# EAGLE design power_breakout_v1 (EAGLE 9.5.2)
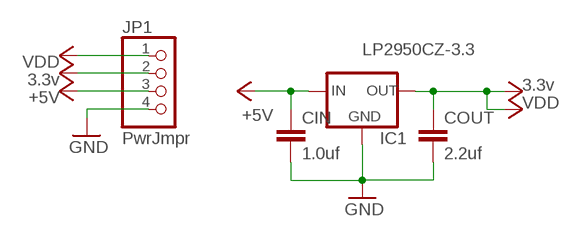
[diagram p0: schematic, sheet 1]

## Parts
CIN  1.0uf  C-EU025-025X050  [C025-025X050]
COUT  2.2uf  C-EU025-025X050  [C025-025X050]
IC1  LP2950CZ-3.3  [TO92]
JP1  PwrJmpr  PINHD-1X4  [1X04]

## Nets
+5V: CIN.1 IC1.3(IN) JP1.3
GND: CIN.2 COUT.2 IC1.2(GND) JP1.4
VCC: COUT.1 IC1.1(OUT) JP1.1 JP1.2 ; supply symbol labelled 3.3v, VDD

## Library data of the parts
CIN COUT = rcl:C-EU: CAPACITOR, European symbol; SPICEPREFIX: C
IC1 = v-reg:LP2950?*: Source: http://cache.national.com/ds/LP/LP2950.pdf
JP1 = pinhead:PINHD-1X4: PIN HEADER

## Board
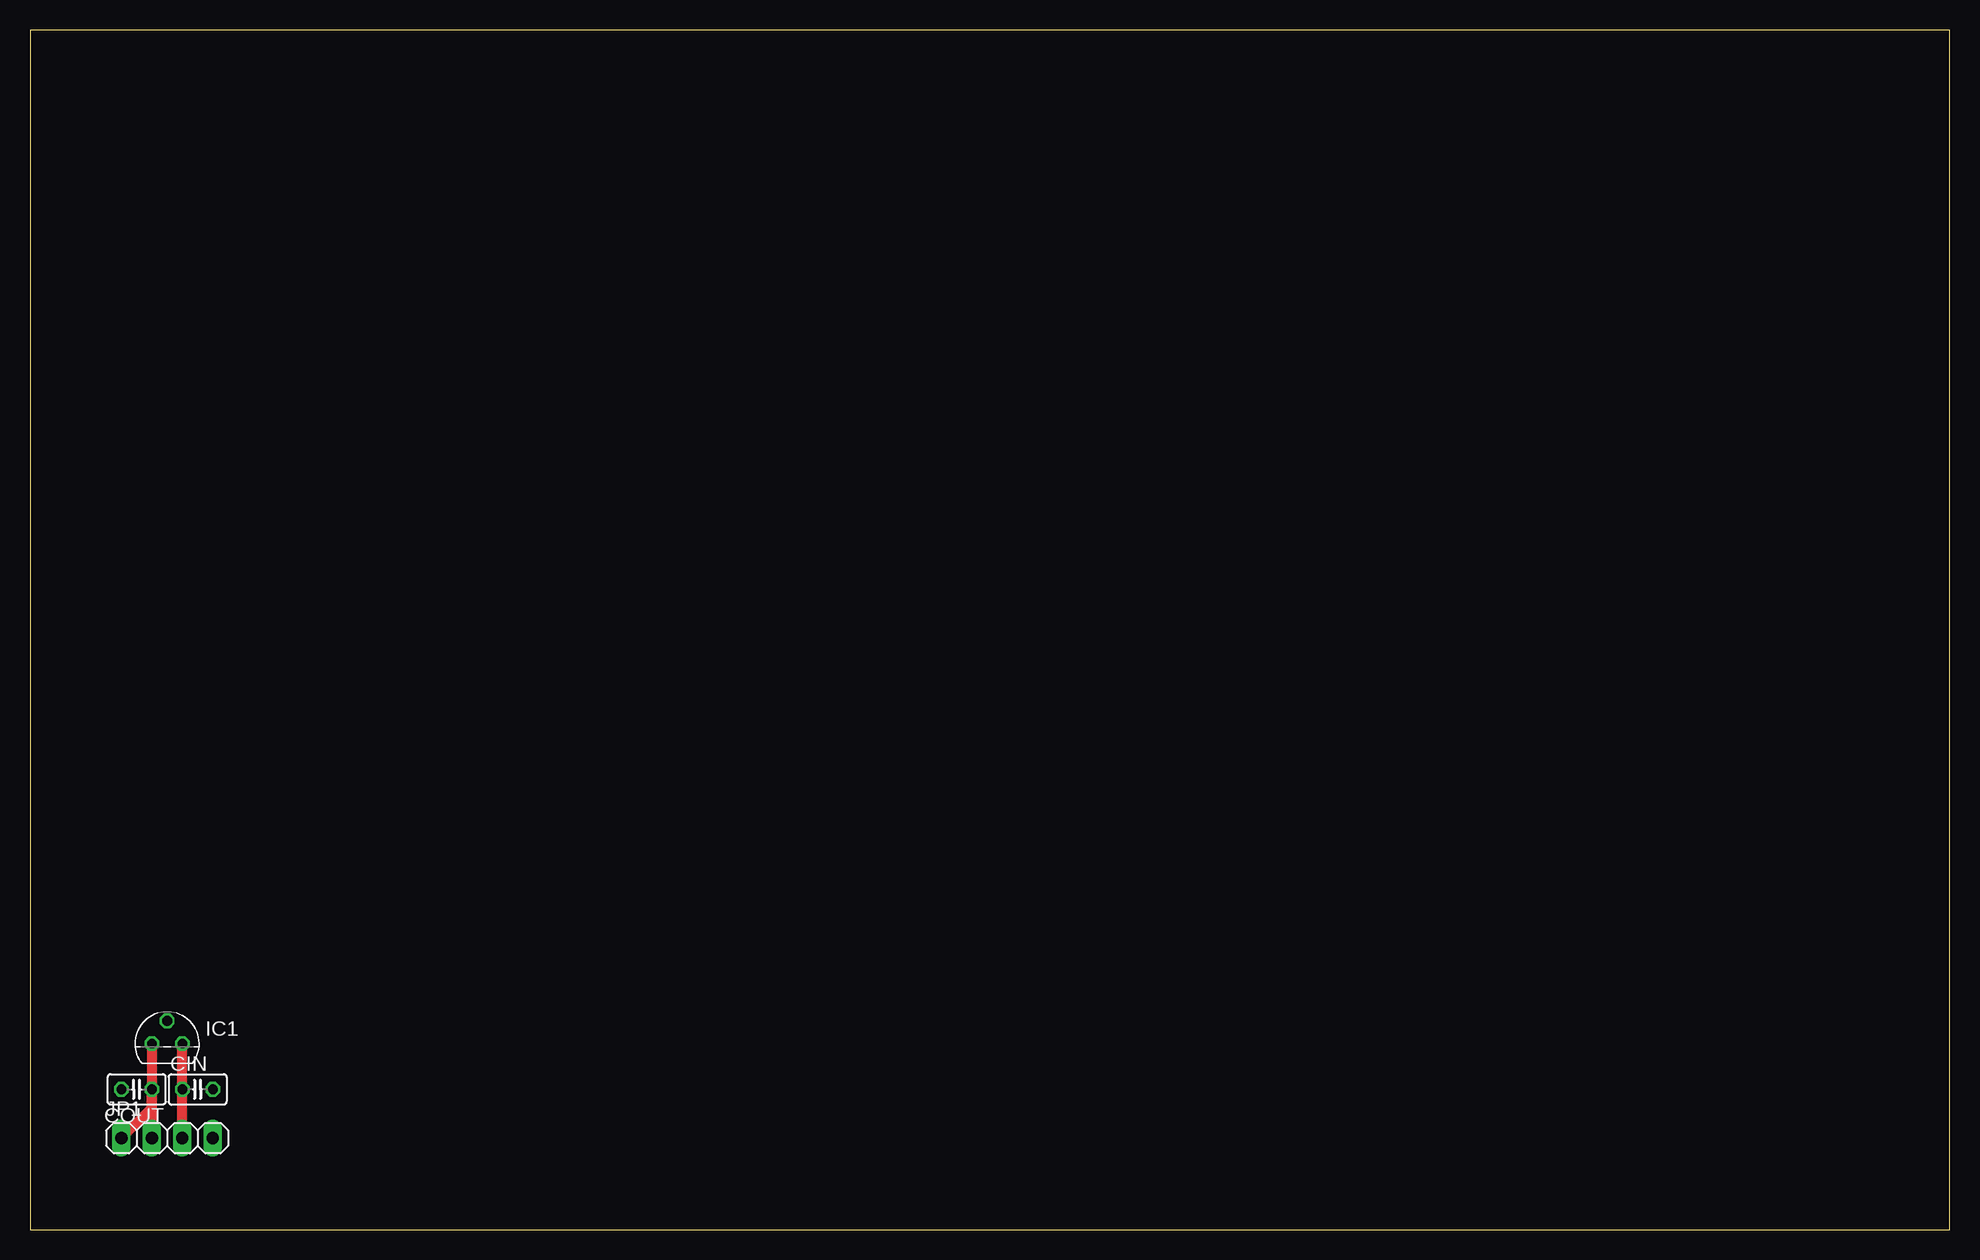
[diagram p1: board, top side]
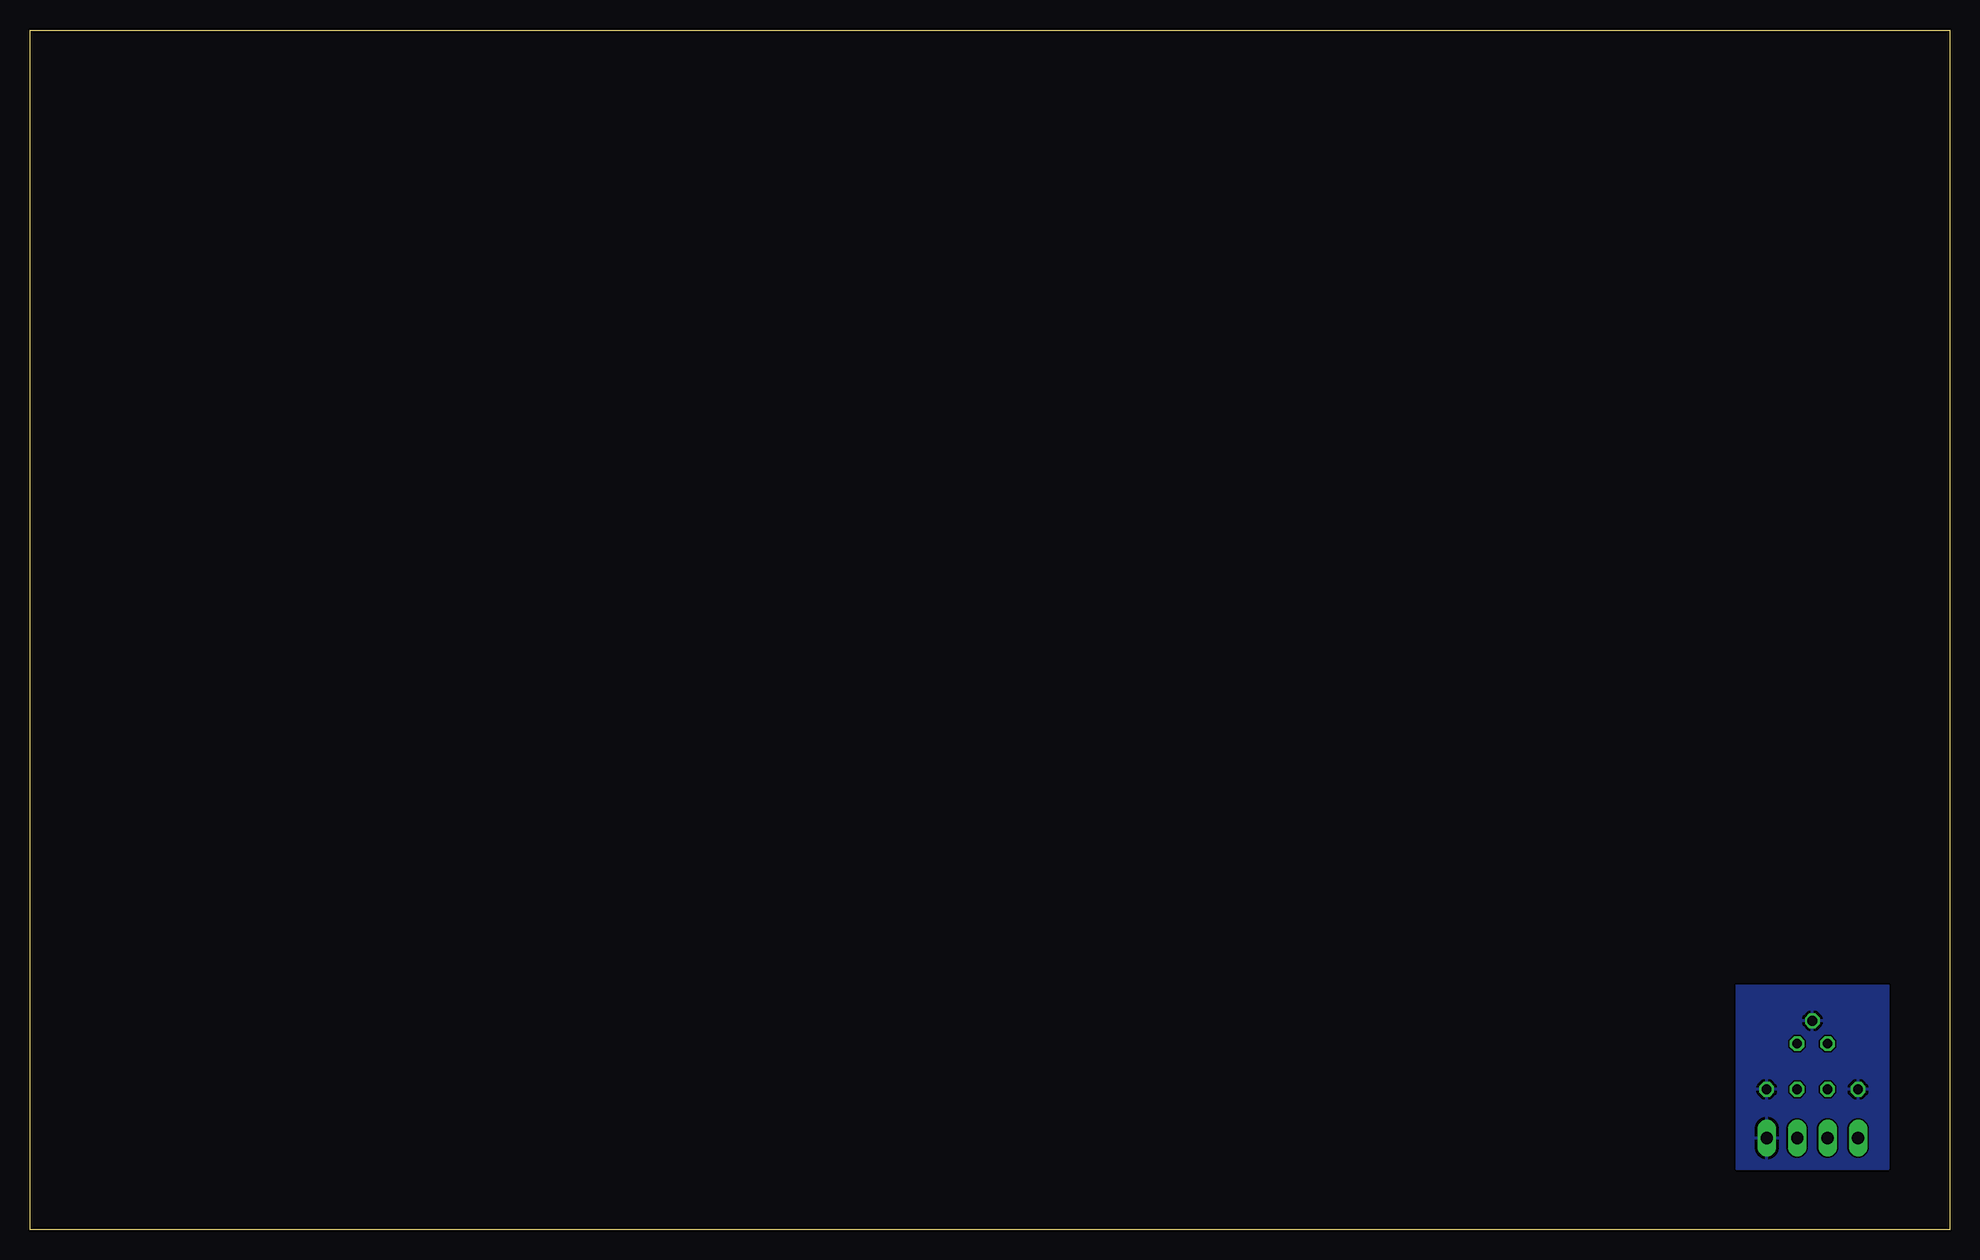
[diagram p2: board, bottom side, seen from below]

Size 160 x 100 mm. Coordinates in mm from the lower left corner, seen from the top.
Outline: 0,0 160,0 160,100 0,100 0,0
Copper layers (1*16): Top 0.035mm / dielectric 1.5mm / Bottom 0.035mm
Design rules "PCBWay_2layer": minimum track width 6mil, minimum drill 0.3mm, track to track 6mil, track to pad 6mil, pad to pad 6mil, via to via 6mil, smd to smd 4mil, copper to edge 10mil, drill to drill 6mil, minimum pad ring 6mil, minimum via ring 6mil, stop-mask expansion 4mil, vias tented up to drill 0.8mm, thermal gap 10mil

### Footprints (pad centres in the part's own frame; a part is rotated, then mirrored left to right if it is on the bottom)
C025-025X050 = drill 0.813 octagon: 1 -1.27,0; 2 1.27,0
TO92 = drill 0.813 octagon: 1 -1.27,0; 2 0,1.905; 3 1.27,0
1X04 = drill 1.016 long: 1 -3.81,0; 2 -1.27,0; 3 1.27,0; 4 3.81,0

### Placement (x,y rotation side)
CIN  13.97,11.68 0 top
COUT  8.89,11.68 180 top
IC1  11.43,15.49 0 top
JP1  11.43,7.62 0 top

### Tracks (layer width: path | path; a pad name or v marks a point on that pad's centre or on a via)
+5V
  Top 0.813: JP1.3 CIN.1 IC1.3
GND
  pour Bottom: 5.08,20.32 17.78,20.32 17.78,5.08 5.08,5.08
VCC
  Top 0.813: IC1.1 COUT.1 | COUT.1 JP1.2 | JP1.1 10.16,10.16 COUT.1